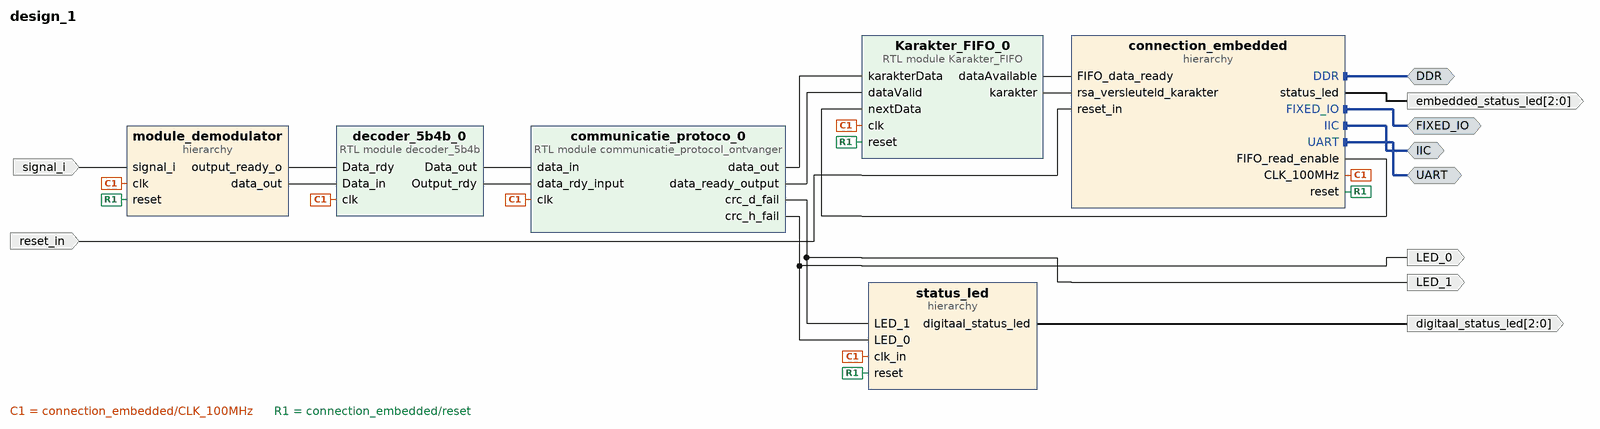
[diagram p0: block diagram of the top level]
# Vivado block design design_1, xc7z020clg400-1, Vivado 2023.1
create_bd_design design_1

create_bd_intf_port -mode Master -vlnv xilinx.com:interface:ddrx_rtl:1.0 DDR
create_bd_intf_port -mode Master -vlnv xilinx.com:display_processing_system7:fixedio_rtl:1.0 FIXED_IO
create_bd_intf_port -mode Master -vlnv xilinx.com:interface:uart_rtl:1.0 UART
create_bd_intf_port -mode Master -vlnv xilinx.com:interface:iic_rtl:1.0 IIC
create_bd_port -dir O -from 2 -to 0 embedded_status_led
create_bd_port -dir I signal_i
create_bd_port -dir I -type rst reset_in
set_property -dict {CONFIG.POLARITY ACTIVE_HIGH} [get_bd_ports reset_in]
create_bd_port -dir O LED_0
create_bd_port -dir O LED_1
create_bd_port -dir O -from 2 -to 0 digitaal_status_led

create_bd_cell -type hier connection_embedded
create_bd_cell -type module -reference decoder_5b4b decoder_5b4b_0
create_bd_cell -type hier module_demodulator
create_bd_cell -type module -reference Karakter_FIFO Karakter_FIFO_0
create_bd_cell -type hier status_led
create_bd_cell -type module -reference communicatie_protocol_ontvanger communicatie_protoco_0

# ---- hierarchy /connection_embedded ----
current_bd_instance /connection_embedded
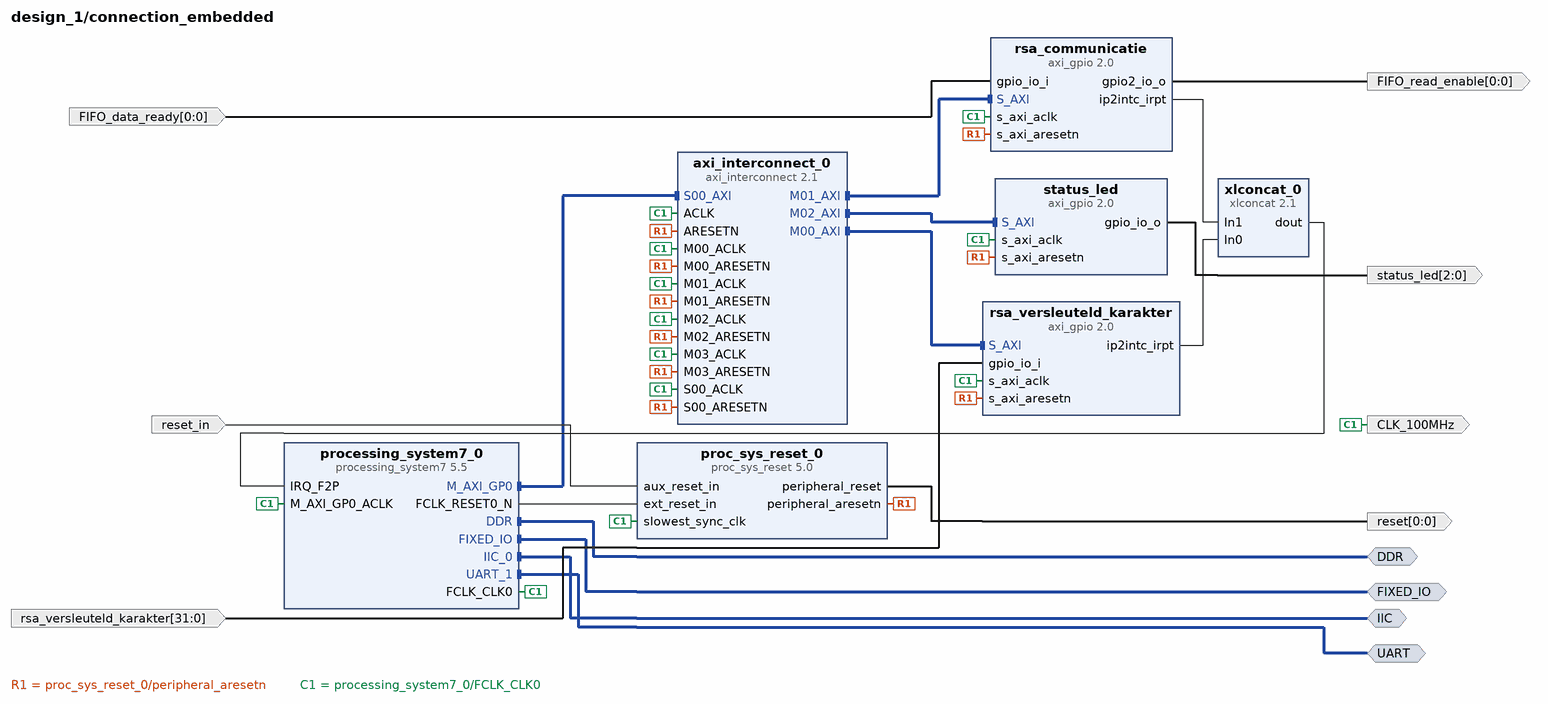
[diagram p1: block diagram inside /connection_embedded]
create_bd_intf_pin -mode Master -vlnv xilinx.com:interface:ddrx_rtl:1.0 DDR
create_bd_intf_pin -mode Master -vlnv xilinx.com:display_processing_system7:fixedio_rtl:1.0 FIXED_IO
create_bd_intf_pin -mode Master -vlnv xilinx.com:interface:iic_rtl:1.0 IIC
create_bd_intf_pin -mode Master -vlnv xilinx.com:interface:uart_rtl:1.0 UART
create_bd_pin -dir O CLK_100MHz
create_bd_pin -dir I -from 31 -to 0 rsa_versleuteld_karakter
create_bd_pin -dir O -from 2 -to 0 status_led
create_bd_pin -dir O -from 0 -to 0 -type rst reset
create_bd_pin -dir I -type rst reset_in
create_bd_pin -dir I -from 0 -to 0 FIFO_data_ready
create_bd_pin -dir O -from 0 -to 0 FIFO_read_enable

create_bd_cell -type ip -vlnv xilinx.com:ip:processing_system7:5.5 processing_system7_0
set_property -dict [list \
  CONFIG.PCW_APU_PERIPHERAL_FREQMHZ 650 \
  CONFIG.PCW_CRYSTAL_PERIPHERAL_FREQMHZ 50 \
  CONFIG.PCW_ENET0_PERIPHERAL_ENABLE 0 \
  CONFIG.PCW_FPGA0_PERIPHERAL_FREQMHZ 100 \
  CONFIG.PCW_FPGA1_PERIPHERAL_FREQMHZ 50 \
  CONFIG.PCW_GPIO_MIO_GPIO_ENABLE 1 \
  CONFIG.PCW_GPIO_MIO_GPIO_IO MIO \
  CONFIG.PCW_I2C0_I2C0_IO EMIO \
  CONFIG.PCW_I2C0_PERIPHERAL_ENABLE 1 \
  CONFIG.PCW_I2C_PERIPHERAL_FREQMHZ 108.333336 \
  CONFIG.PCW_I2C_RESET_ENABLE 0 \
  CONFIG.PCW_IRQ_F2P_INTR 1 \
  CONFIG.PCW_M_AXI_GP0_FREQMHZ 10 \
  CONFIG.PCW_PERIPHERAL_BOARD_PRESET part0 \
  CONFIG.PCW_PRESET_BANK1_VOLTAGE {LVCMOS 1.8V} \
  CONFIG.PCW_QSPI_GRP_FBCLK_ENABLE 1 \
  CONFIG.PCW_QSPI_GRP_FBCLK_IO {MIO 8} \
  CONFIG.PCW_QSPI_GRP_SINGLE_SS_ENABLE 1 \
  CONFIG.PCW_QSPI_GRP_SINGLE_SS_IO {MIO 1 .. 6} \
  CONFIG.PCW_QSPI_PERIPHERAL_ENABLE 1 \
  CONFIG.PCW_QSPI_QSPI_IO {MIO 1 .. 6} \
  CONFIG.PCW_SD0_PERIPHERAL_ENABLE 0 \
  CONFIG.PCW_SINGLE_QSPI_DATA_MODE x4 \
  CONFIG.PCW_UART0_PERIPHERAL_ENABLE 1 \
  CONFIG.PCW_UART0_UART0_IO {MIO 14 .. 15} \
  CONFIG.PCW_UART1_PERIPHERAL_ENABLE 1 \
  CONFIG.PCW_UART1_UART1_IO EMIO \
  CONFIG.PCW_UART_PERIPHERAL_FREQMHZ 100 \
  CONFIG.PCW_UIPARAM_DDR_BUS_WIDTH {16 Bit} \
  CONFIG.PCW_UIPARAM_DDR_FREQ_MHZ 525 \
  CONFIG.PCW_UIPARAM_DDR_PARTNO {MT41J256M16 RE-125} \
  CONFIG.PCW_USB0_PERIPHERAL_ENABLE 0 \
  CONFIG.PCW_USB_RESET_ENABLE 1 \
  CONFIG.PCW_USE_FABRIC_INTERRUPT 1 \
] [get_bd_cells processing_system7_0]
# 492 more settings of processing_system7_0 are not shown: defaults, MIO pin electricals, DDR timing, and values the tool derives
create_bd_cell -type ip -vlnv xilinx.com:ip:proc_sys_reset:5.0 proc_sys_reset_0
set_property -dict {CONFIG.C_AUX_RESET_HIGH 1 CONFIG.C_AUX_RST_WIDTH 1} [get_bd_cells proc_sys_reset_0]
create_bd_cell -type ip -vlnv xilinx.com:ip:axi_interconnect:2.1 axi_interconnect_0
set_property -dict {CONFIG.NUM_MI 4} [get_bd_cells axi_interconnect_0]
create_bd_cell -type ip -vlnv xilinx.com:ip:axi_gpio:2.0 rsa_versleuteld_karakter
set_property -dict {CONFIG.C_ALL_INPUTS 1 CONFIG.C_INTERRUPT_PRESENT 1 CONFIG.C_IS_DUAL 0} [get_bd_cells rsa_versleuteld_karakter]
create_bd_cell -type ip -vlnv xilinx.com:ip:axi_gpio:2.0 rsa_communicatie
set_property -dict [list \
  CONFIG.C_ALL_INPUTS 1 \
  CONFIG.C_ALL_OUTPUTS_2 1 \
  CONFIG.C_GPIO2_WIDTH 1 \
  CONFIG.C_GPIO_WIDTH 1 \
  CONFIG.C_INTERRUPT_PRESENT 1 \
  CONFIG.C_IS_DUAL 1 \
] [get_bd_cells rsa_communicatie]
create_bd_cell -type ip -vlnv xilinx.com:ip:xlconcat:2.1 xlconcat_0
set_property -dict {CONFIG.NUM_PORTS 4} [get_bd_cells xlconcat_0]
create_bd_cell -type ip -vlnv xilinx.com:ip:axi_gpio:2.0 status_led
set_property -dict [list \
  CONFIG.C_ALL_OUTPUTS 1 \
  CONFIG.C_GPIO_WIDTH 3 \
  CONFIG.GPIO_BOARD_INTERFACE Custom \
  CONFIG.USE_BOARD_FLOW true \
] [get_bd_cells status_led]

# ---- hierarchy /module_demodulator ----
current_bd_instance /module_demodulator
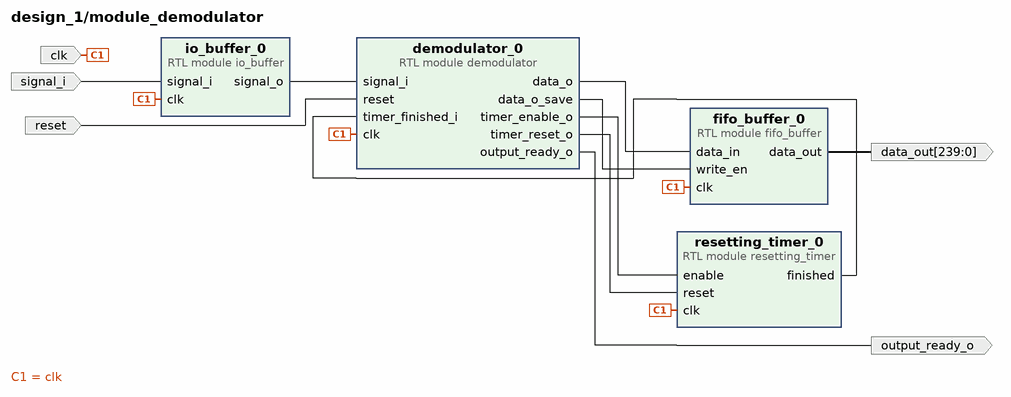
[diagram p2: block diagram inside /module_demodulator]
create_bd_pin -dir I -type clk clk
create_bd_pin -dir I signal_i
create_bd_pin -dir I -type rst reset
create_bd_pin -dir O output_ready_o
create_bd_pin -dir O -from 239 -to 0 data_out

create_bd_cell -type module -reference io_buffer io_buffer_0
create_bd_cell -type module -reference demodulator demodulator_0
create_bd_cell -type module -reference fifo_buffer fifo_buffer_0
set_property -dict {CONFIG.BITS_STORED_WIDTH 8 CONFIG.DEPTH 240 CONFIG.OUTPUT_WIDTH 240} [get_bd_cells fifo_buffer_0]
create_bd_cell -type module -reference resetting_timer resetting_timer_0
set_property -dict {CONFIG.goal 106000} [get_bd_cells resetting_timer_0]

# ---- hierarchy /status_led ----
current_bd_instance /status_led
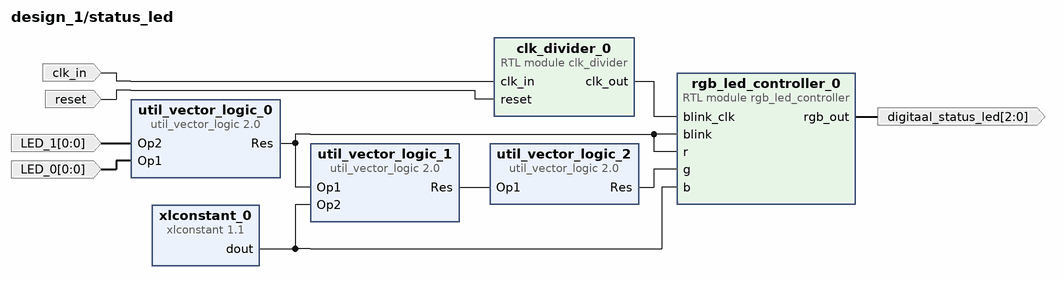
[diagram p3: block diagram inside /status_led]
create_bd_pin -dir I clk_in
create_bd_pin -dir I -type rst reset
create_bd_pin -dir I -from 0 -to 0 LED_0
create_bd_pin -dir I -from 0 -to 0 LED_1
create_bd_pin -dir O -from 2 -to 0 digitaal_status_led

create_bd_cell -type module -reference clk_divider clk_divider_0
set_property -dict {CONFIG.division 50000000} [get_bd_cells clk_divider_0]
create_bd_cell -type ip -vlnv xilinx.com:ip:util_vector_logic:2.0 util_vector_logic_0
set_property -dict {CONFIG.C_OPERATION or CONFIG.C_SIZE 1} [get_bd_cells util_vector_logic_0]
create_bd_cell -type ip -vlnv xilinx.com:ip:util_vector_logic:2.0 util_vector_logic_1
set_property -dict {CONFIG.C_OPERATION or CONFIG.C_SIZE 1} [get_bd_cells util_vector_logic_1]
create_bd_cell -type ip -vlnv xilinx.com:ip:util_vector_logic:2.0 util_vector_logic_2
set_property -dict {CONFIG.C_OPERATION not CONFIG.C_SIZE 1} [get_bd_cells util_vector_logic_2]
create_bd_cell -type ip -vlnv xilinx.com:ip:xlconstant:1.1 xlconstant_0
set_property -dict {CONFIG.CONST_VAL 0} [get_bd_cells xlconstant_0]
create_bd_cell -type module -reference rgb_led_controller rgb_led_controller_0

# ---- connections ----

current_bd_instance /connection_embedded
connect_bd_intf_net [get_bd_intf_pins processing_system7_0/DDR] [get_bd_intf_pins DDR]
connect_bd_intf_net [get_bd_intf_pins processing_system7_0/FIXED_IO] [get_bd_intf_pins FIXED_IO]
connect_bd_intf_net [get_bd_intf_pins processing_system7_0/IIC_0] [get_bd_intf_pins IIC]
connect_bd_intf_net [get_bd_intf_pins processing_system7_0/UART_1] [get_bd_intf_pins UART]
connect_bd_intf_net [get_bd_intf_pins axi_interconnect_0/M00_AXI] [get_bd_intf_pins rsa_versleuteld_karakter/S_AXI]
connect_bd_intf_net [get_bd_intf_pins rsa_communicatie/S_AXI] [get_bd_intf_pins axi_interconnect_0/M01_AXI]
connect_bd_intf_net [get_bd_intf_pins status_led/S_AXI] [get_bd_intf_pins axi_interconnect_0/M02_AXI]
connect_bd_intf_net [get_bd_intf_pins processing_system7_0/M_AXI_GP0] [get_bd_intf_pins axi_interconnect_0/S00_AXI]
connect_bd_net -net aux_reset_in_0_1 [get_bd_pins reset_in] [get_bd_pins proc_sys_reset_0/aux_reset_in]
connect_bd_net -net axi_gpio_0_gpio_io_o [get_bd_pins status_led/gpio_io_o] [get_bd_pins status_led]
connect_bd_net -net gpio_io_i_0_2 [get_bd_pins FIFO_data_ready] [get_bd_pins rsa_communicatie/gpio_io_i]
connect_bd_net [get_bd_pins proc_sys_reset_0/peripheral_aresetn] \
  [get_bd_pins axi_interconnect_0/ARESETN] [get_bd_pins axi_interconnect_0/S00_ARESETN] \
  [get_bd_pins axi_interconnect_0/M00_ARESETN] [get_bd_pins rsa_versleuteld_karakter/s_axi_aresetn] \
  [get_bd_pins axi_interconnect_0/M01_ARESETN] [get_bd_pins axi_interconnect_0/M02_ARESETN] \
  [get_bd_pins rsa_communicatie/s_axi_aresetn] [get_bd_pins axi_interconnect_0/M03_ARESETN] \
  [get_bd_pins status_led/s_axi_aresetn]
connect_bd_net [get_bd_pins proc_sys_reset_0/peripheral_reset] [get_bd_pins reset]
connect_bd_net [get_bd_pins processing_system7_0/FCLK_CLK0] \
  [get_bd_pins axi_interconnect_0/ACLK] [get_bd_pins proc_sys_reset_0/slowest_sync_clk] \
  [get_bd_pins processing_system7_0/M_AXI_GP0_ACLK] [get_bd_pins axi_interconnect_0/S00_ACLK] \
  [get_bd_pins axi_interconnect_0/M00_ACLK] [get_bd_pins CLK_100MHz] [get_bd_pins rsa_versleuteld_karakter/s_axi_aclk] \
  [get_bd_pins axi_interconnect_0/M01_ACLK] [get_bd_pins axi_interconnect_0/M02_ACLK] \
  [get_bd_pins rsa_communicatie/s_axi_aclk] [get_bd_pins axi_interconnect_0/M03_ACLK] [get_bd_pins status_led/s_axi_aclk]
connect_bd_net [get_bd_pins processing_system7_0/FCLK_RESET0_N] [get_bd_pins proc_sys_reset_0/ext_reset_in]
connect_bd_net [get_bd_pins rsa_communicatie/gpio2_io_o] [get_bd_pins FIFO_read_enable]
connect_bd_net [get_bd_pins rsa_versleuteld_karakter] [get_bd_pins rsa_versleuteld_karakter/gpio_io_i]
connect_bd_net -net rsa_versleuteld_karakter_1_ip2intc_irpt [get_bd_pins rsa_versleuteld_karakter/ip2intc_irpt] [get_bd_pins xlconcat_0/In0]
connect_bd_net -net rsa_versleuteld_karakter_4_ip2intc_irpt [get_bd_pins rsa_communicatie/ip2intc_irpt] [get_bd_pins xlconcat_0/In1]
connect_bd_net [get_bd_pins xlconcat_0/dout] [get_bd_pins processing_system7_0/IRQ_F2P]

current_bd_instance /module_demodulator
connect_bd_net [get_bd_pins clk] \
  [get_bd_pins demodulator_0/clk] [get_bd_pins fifo_buffer_0/clk] [get_bd_pins io_buffer_0/clk] \
  [get_bd_pins resetting_timer_0/clk]
connect_bd_net -net connection_embedded_reset [get_bd_pins reset] [get_bd_pins demodulator_0/reset]
connect_bd_net [get_bd_pins demodulator_0/data_o] [get_bd_pins fifo_buffer_0/data_in]
connect_bd_net [get_bd_pins demodulator_0/data_o_save] [get_bd_pins fifo_buffer_0/write_en]
connect_bd_net [get_bd_pins demodulator_0/output_ready_o] [get_bd_pins output_ready_o]
connect_bd_net [get_bd_pins demodulator_0/timer_enable_o] [get_bd_pins resetting_timer_0/enable]
connect_bd_net [get_bd_pins demodulator_0/timer_reset_o] [get_bd_pins resetting_timer_0/reset]
connect_bd_net [get_bd_pins fifo_buffer_0/data_out] [get_bd_pins data_out]
connect_bd_net [get_bd_pins io_buffer_0/signal_o] [get_bd_pins demodulator_0/signal_i]
connect_bd_net [get_bd_pins resetting_timer_0/finished] [get_bd_pins demodulator_0/timer_finished_i]
connect_bd_net -net signal_i_0_1 [get_bd_pins signal_i] [get_bd_pins io_buffer_0/signal_i]

current_bd_instance /status_led
connect_bd_net [get_bd_pins clk_in] [get_bd_pins clk_divider_0/clk_in]
connect_bd_net [get_bd_pins xlconstant_0/dout] [get_bd_pins util_vector_logic_1/Op2] [get_bd_pins rgb_led_controller_0/b]
connect_bd_net [get_bd_pins clk_divider_0/clk_out] [get_bd_pins rgb_led_controller_0/blink_clk]
connect_bd_net -net communicatie_protoco_0_crc_d_fail [get_bd_pins LED_1] [get_bd_pins util_vector_logic_0/Op2]
connect_bd_net -net communicatie_protoco_0_crc_h_fail [get_bd_pins LED_0] [get_bd_pins util_vector_logic_0/Op1]
connect_bd_net -net connection_embedded_reset [get_bd_pins reset] [get_bd_pins clk_divider_0/reset]
connect_bd_net [get_bd_pins rgb_led_controller_0/rgb_out] [get_bd_pins digitaal_status_led]
connect_bd_net [get_bd_pins util_vector_logic_0/Res] \
  [get_bd_pins util_vector_logic_1/Op1] [get_bd_pins rgb_led_controller_0/blink] [get_bd_pins rgb_led_controller_0/r]
connect_bd_net [get_bd_pins util_vector_logic_1/Res] [get_bd_pins util_vector_logic_2/Op1]
connect_bd_net [get_bd_pins util_vector_logic_2/Res] [get_bd_pins rgb_led_controller_0/g]

current_bd_instance /
connect_bd_intf_net -intf_net koppeling_embedded_DDR [get_bd_intf_ports DDR] [get_bd_intf_pins connection_embedded/DDR]
connect_bd_intf_net -intf_net koppeling_embedded_FIXED_IO [get_bd_intf_ports FIXED_IO] [get_bd_intf_pins connection_embedded/FIXED_IO]
connect_bd_intf_net -intf_net koppeling_embedded_IIC [get_bd_intf_ports IIC] [get_bd_intf_pins connection_embedded/IIC]
connect_bd_intf_net -intf_net koppeling_embedded_UART_1_0 [get_bd_intf_ports UART] [get_bd_intf_pins connection_embedded/UART]
connect_bd_net [get_bd_pins Karakter_FIFO_0/dataAvailable] [get_bd_pins connection_embedded/FIFO_data_ready]
connect_bd_net [get_bd_pins Karakter_FIFO_0/karakter] [get_bd_pins connection_embedded/rsa_versleuteld_karakter]
connect_bd_net [get_bd_pins connection_embedded/CLK_100MHz] \
  [get_bd_pins decoder_5b4b_0/clk] [get_bd_pins module_demodulator/clk] [get_bd_pins Karakter_FIFO_0/clk] \
  [get_bd_pins status_led/clk_in] [get_bd_pins communicatie_protoco_0/clk]
connect_bd_net -net aux_reset_in_0_1 [get_bd_ports reset_in] [get_bd_pins connection_embedded/reset_in]
connect_bd_net [get_bd_pins communicatie_protoco_0/crc_d_fail] [get_bd_ports LED_1] [get_bd_pins status_led/LED_1]
connect_bd_net [get_bd_pins communicatie_protoco_0/crc_h_fail] [get_bd_ports LED_0] [get_bd_pins status_led/LED_0]
connect_bd_net [get_bd_pins communicatie_protoco_0/data_out] [get_bd_pins Karakter_FIFO_0/karakterData]
connect_bd_net [get_bd_pins communicatie_protoco_0/data_ready_output] [get_bd_pins Karakter_FIFO_0/dataValid]
connect_bd_net [get_bd_pins connection_embedded/FIFO_read_enable] [get_bd_pins Karakter_FIFO_0/nextData]
connect_bd_net -net connection_embedded_gpio_io_o_0 [get_bd_pins connection_embedded/status_led] [get_bd_ports embedded_status_led]
connect_bd_net [get_bd_pins connection_embedded/reset] \
  [get_bd_pins module_demodulator/reset] [get_bd_pins Karakter_FIFO_0/reset] [get_bd_pins status_led/reset]
connect_bd_net [get_bd_pins decoder_5b4b_0/Data_out] [get_bd_pins communicatie_protoco_0/data_in]
connect_bd_net [get_bd_pins decoder_5b4b_0/Output_rdy] [get_bd_pins communicatie_protoco_0/data_rdy_input]
connect_bd_net -net demodulator_0_output_ready_o [get_bd_pins module_demodulator/output_ready_o] [get_bd_pins decoder_5b4b_0/Data_rdy]
connect_bd_net -net fifo_buffer_0_data_out [get_bd_pins module_demodulator/data_out] [get_bd_pins decoder_5b4b_0/Data_in]
connect_bd_net -net rgb_led_controller_0_rgb_out [get_bd_pins status_led/digitaal_status_led] [get_bd_ports digitaal_status_led]
connect_bd_net -net signal_i_0_1 [get_bd_ports signal_i] [get_bd_pins module_demodulator/signal_i]

# ---- address map ----
assign_bd_address -offset 0x41200000 -range 64K -target_address_space [get_bd_addr_spaces connection_embedded/processing_system7_0/Data] [get_bd_addr_segs connection_embedded/rsa_versleuteld_karakter/S_AXI/Reg]
assign_bd_address -offset 0x41230000 -range 64K -target_address_space [get_bd_addr_spaces connection_embedded/processing_system7_0/Data] [get_bd_addr_segs connection_embedded/rsa_communicatie/S_AXI/Reg]
assign_bd_address -offset 0x41240000 -range 64K -target_address_space [get_bd_addr_spaces connection_embedded/processing_system7_0/Data] [get_bd_addr_segs connection_embedded/status_led/S_AXI/Reg]

validate_bd_design
save_bd_design
